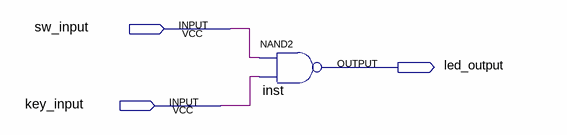
[diagram p0: schematic sheet]
// Quartus schematic key_led.bdf as structural Verilog: 1 symbols, 3 pins
module key_led (
  input  sw_input,
  input  key_input,
  output led_output
);

  nand inst (led_output, sw_input, key_input);
endmodule
